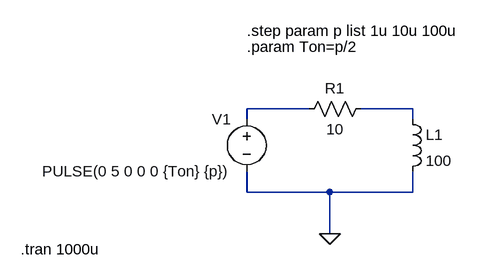
[diagram p0: schematic RL with .step and .param func..asc]
RL with .step and .param func..asc, the LTspice schematic file:
Version 4
SHEET 1 880 680
WIRE 16 128 -80 128
WIRE 176 128 96 128
WIRE -80 144 -80 128
WIRE 176 144 176 128
WIRE -80 256 -80 224
WIRE 48 256 -80 256
WIRE 176 256 176 224
WIRE 176 256 48 256
WIRE 48 320 48 256
FLAG 48 320 0
SYMBOL res 112 112 R90
WINDOW 0 0 56 VBottom 2
WINDOW 3 32 56 VTop 2
SYMATTR InstName R1
SYMATTR Value 10
SYMBOL ind 160 128 R0
SYMATTR InstName L1
SYMATTR Value 100
SYMBOL voltage -80 128 M0
WINDOW 123 0 0 Left 0
WINDOW 39 0 0 Left 0
SYMATTR InstName V1
SYMATTR Value PULSE(0 5 0 0 0 {Ton} {p})
TEXT -80 8 Left 2 !.step param p list 1u 10u 100u
TEXT -80 32 Left 2 !.param Ton=p/2
TEXT -428 344 Left 2 !.tran 1000u

The netlist it stands for:
* RL with .step and .param func..asc
R1 N002 N001 10
L1 N002 0 100
V1 N001 0 PULSE(0 5 0 0 0 {Ton} {p})
.step param p list 1u 10u 100u
.param Ton=p/2
.tran 1000u
.backanno
.end